# Altium schematic sheet Micro Controller.SchDoc: Micro Controller
size A4; Author: DO DANH LUONG; Revision: 1.0; SheetNumber: 4; SheetTotal: 6; ProjectTitle: DSP_VERSION_1.0
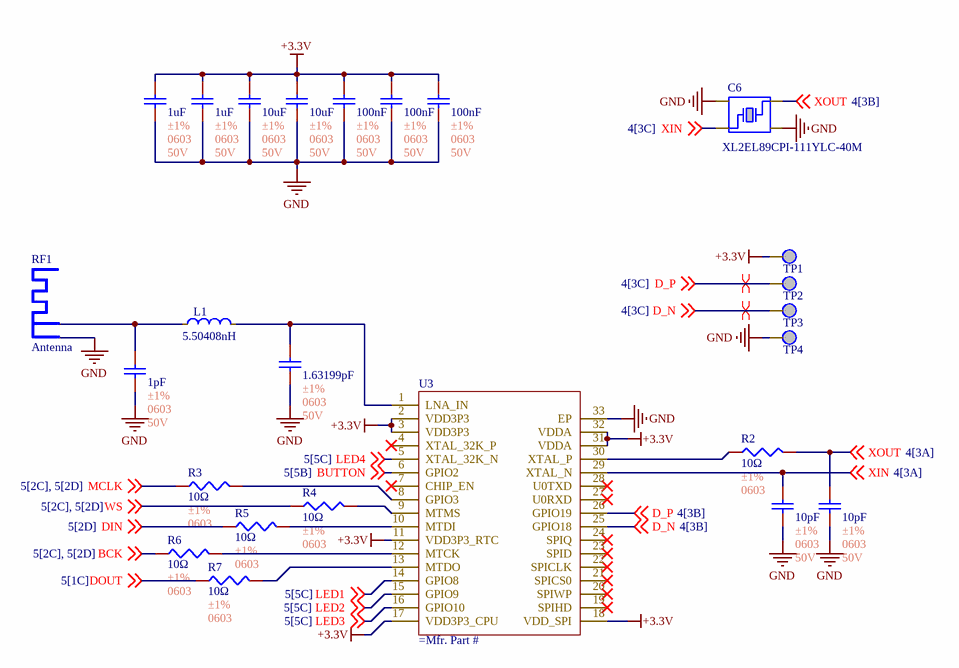
[diagram p0: Micro Controller.SchDoc]

## Parts
C6  XL2EL89CPI-111YLC-40M  [XL2EL89CPI-111YLC-40M]
C7  1uF  Tolerance: ±1%  Package: 0603  Voltage Rating: 50V  [C0603]
C8  1uF  Tolerance: ±1%  Package: 0603  Voltage Rating: 50V  [C0603]
C9  10uF  Tolerance: ±1%  Package: 0603  Voltage Rating: 50V  [C0603]
C10  10uF  Tolerance: ±1%  Package: 0603  Voltage Rating: 50V  [C0603]
C11  100nF  Tolerance: ±1%  Package: 0603  Voltage Rating: 50V  [C0603]
C12  100nF  Tolerance: ±1%  Package: 0603  Voltage Rating: 50V  [C0603]
C13  100nF  Tolerance: ±1%  Package: 0603  Voltage Rating: 50V  [C0603]
C14  1pF  Tolerance: ±1%  Package: 0603  Voltage Rating: 50V  [C0603]
C15  1.63199pF  Tolerance: ±1%  Package: 0603  Voltage Rating: 50V  [C0603]
C16  10pF  Tolerance: ±1%  Package: 0603  Voltage Rating: 50V  [C0603]
C17  10pF  Tolerance: ±1%  Package: 0603  Voltage Rating: 50V  [C0603]
L1  5.50408nH  [0603CT-3N0XGRW]
R2  10Ω  Tolerance: ±1%  Package: 0603  [R0603]
R3  10Ω  Tolerance: ±1%  Package: 0603  [R0603]
R4  10Ω  Tolerance: ±1%  Package: 0603  [R0603]
R5  10Ω  Tolerance: ±1%  Package: 0603  [R0603]
R6  10Ω  Tolerance: ±1%  Package: 0603  [R0603]
R7  10Ω  Tolerance: ±1%  Package: 0603  [R0603]
RF1  Antenna  [2.4GHZ-50OHMS_v1.1]
TP1  TP  [TP]  (value not drawn)
TP2  TP  [TP]  (value not drawn)
TP3  TP  [TP]  (value not drawn)
TP4  TP  [TP]  (value not drawn)
U3  (no value)  [ESP32-C3]

## Nets
+3.3V: C7.1 C8.1 C9.1 C10.1 C11.1 C12.1 C13.1 TP1.1 U3.2(VDD3P3) U3.3(VDD3P3) U3.11(VDD3P3_RTC) U3.17(VDD3P3_CPU) U3.18(VDD_SPI) U3.31(VDDA) U3.32(VDDA)
GND: C6.2 C6.4 C7.2 C8.2 C9.2 C10.2 C11.2 C12.2 C13.2 C14.2 C15.2 C16.2 C17.2 RF1.2 TP4.1 U3.33(EP)
BCK: R6.1 ; off-sheet BCK
BUTTON: U3.6(GPIO2) ; off-sheet BUTTON
D_N: TP3.1 U3.25(GPIO18) ; off-sheet D_N
D_P: TP2.1 U3.26(GPIO19) ; off-sheet D_P
DIN: R5.1 ; off-sheet DIN
DOUT: R7.1 ; off-sheet DOUT
LED1: U3.14(GPIO8) ; off-sheet LED1
LED2: U3.15(GPIO9) ; off-sheet LED2
LED3: U3.16(GPIO10) ; off-sheet LED3
LED4: U3.5(XTAL_32K_N) ; off-sheet LED4
MCLK: R3.1 ; off-sheet MCLK
WS: R4.1 ; off-sheet WS
XIN: C6.1 C16.1 U3.29(XTAL_N) ; off-sheet XIN
XOUT: C6.3 C17.1 R2.2 ; off-sheet XOUT
NetC14_1: C14.1 L1.1 RF1.1
NetC15_1: C15.1 L1.2 U3.1(LNA_IN)
NetR2_1: R2.1 U3.30(XTAL_P)
NetR3_2: R3.2 U3.8(GPIO3)
NetR4_2: R4.2 U3.9(MTMS)
NetR5_2: R5.2 U3.10(MTDI)
NetR6_2: R6.2 U3.12(MTCK)
NetR7_2: R7.2 U3.13(MTDO)

Not connected (* = marked no-connect by the designer): U3 4(XTAL_32K_P)* 7(CHIP_EN)* 19(SPIHD)* 20(SPIWP)* 21(SPICS0)* 22(SPICLK)* 23(SPID)* 24(SPIQ)* 27(U0RXD)* 28(U0TXD)*

## Layout directives
differential pair: D_N, D_P

## Notes on the sheet
- Author:
- Title:
- Size:
- A4
- Project:
- Approved:
- Revision:
- Modified Date:
- CONFIDENTIAL
- Date:
- SW Version:

## Library data of the parts
C6 = XL2EL89CPI-111YLC-40M: Crystal Oscillator 15pF SMD3225-4P Crystals RoHS; Manufacturer: YXC Crystal Oscillators; Mfr. Part #: XL2EL89CPI-111YLC-40M; LCSC Part #: C5444549; Package: SMD3225-4P; Link: https://www.lcsc.com/product-detail/C5444549.html?s_z=n_oscillator; Key Attributes: Crystal Oscillator 15pF SMD3225-4P Crystals RoHS
C7 C8 = C0603_1uF_±1%: 50V 10pF NP0 ±1% 0402 Multilayer Ceramic Capacitors MLCC - SMD/SMT ROHS; Manufacturer: YAGEO; Mfr. Part #: CC0402FRNPO9BN100; LCSC Part #: C513681; Link: https://www.lcsc.com/product-detail/C513681.html?s_z=n_capital%2520yageo%252010pF%25200402; Capacitance: 1uF
C9 C10 = C0603_10uF_±1%: 50V 10pF NP0 ±1% 0402 Multilayer Ceramic Capacitors MLCC - SMD/SMT ROHS; Manufacturer: YAGEO; Mfr. Part #: CC0402FRNPO9BN100; LCSC Part #: C513681; Link: https://www.lcsc.com/product-detail/C513681.html?s_z=n_capital%2520yageo%252010pF%25200402; Capacitance: 10uF
C11-C13 = C0603_100nF_±1%: 50V 10pF NP0 ±1% 0402 Multilayer Ceramic Capacitors MLCC - SMD/SMT ROHS; Manufacturer: YAGEO; Mfr. Part #: CC0402FRNPO9BN100; LCSC Part #: C513681; Link: https://www.lcsc.com/product-detail/C513681.html?s_z=n_capital%2520yageo%252010pF%25200402; Capacitance: 100nF
C14-C17 = C0603_10pF_±1%: 50V 10pF NP0 ±1% 0402 Multilayer Ceramic Capacitors MLCC - SMD/SMT ROHS; Manufacturer: YAGEO; Mfr. Part #: CC0402FRNPO9BN100; LCSC Part #: C513681; Link: https://www.lcsc.com/product-detail/C513681.html?s_z=n_capital%2520yageo%252010pF%25200402; Capacitance: 10pF
L1 = L_3nH_3.6A_0603: 1.6A 3nH 39mΩ Wire-wound chip inductor ±2% 0603 Fixed Inductors RoHS; Manufacturer: Coilcraft; Mfr. Part #: 0603CT-3N0XGRW; LCSC Part #: C41050064; Package: 0603; Key Attributes: 1.6A 3nH 39mΩ Wire-wound chip inductor ±2% 0603 Fixed Inductors RoHS; Link: https://www.lcsc.com/product-detail/C41050064.html?s_z=n_inductor%25203nH%25200603
R2-R7 = R0603_10Ω_±1%: 62.5mW Thick Film Resistor 50V ±1% ±200ppm/℃ 10Ω 0402 Chip Resistor - Surface Mount ROHS; Manufacturer: YAGEO; Mfr. Part #: RC0402FR-0710RL; LCSC Part #: C138066; Resistance: 10Ω; Link: https://www.lcsc.com/product-detail/C138066.html?s_z=n_resistor%25200402%252010R
U3 = ESP32-C3: Others 160MHz QFN-32-EP(5x5) RF Transceiver Modules and Modems RoHS; Manufacturer: ESPRESSIF; LCSC Part #: C2838500; Package: QFN-32-EP(5x5); Link: https://www.lcsc.com/product-detail/C2838500.html?s_z=n_ESP32%2520C3